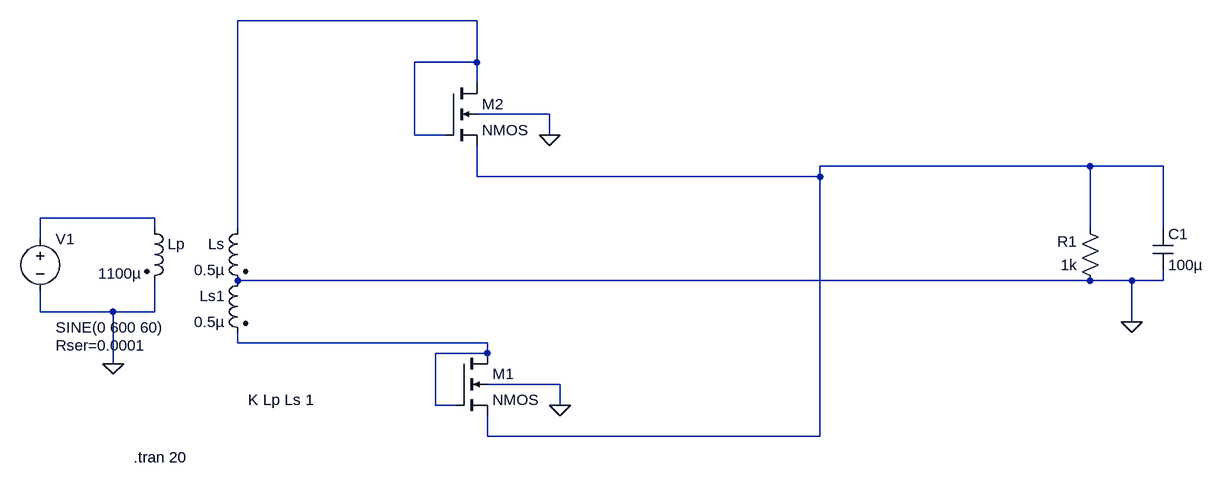
[diagram p0: schematic Rectification Sim.asc]
Rectification Sim.asc, the LTspice schematic file:
Version 4
SHEET 1 1284 680
WIRE 144 -192 -224 -192
WIRE 144 -128 144 -192
WIRE 144 -128 48 -128
WIRE 144 -96 144 -128
WIRE 256 -48 144 -48
WIRE 48 -16 48 -128
WIRE 96 -16 48 -16
WIRE 256 -16 256 -48
WIRE 1088 32 672 32
WIRE 1200 32 1088 32
WIRE 144 48 144 0
WIRE 672 48 672 32
WIRE 672 48 144 48
WIRE -352 112 -528 112
WIRE -352 128 -352 112
WIRE -224 128 -224 -192
WIRE 1088 128 1088 32
WIRE 1200 128 1200 32
WIRE -528 144 -528 112
WIRE 1088 208 -224 208
WIRE 1152 208 1088 208
WIRE 1200 208 1200 192
WIRE 1200 208 1152 208
WIRE -528 256 -528 224
WIRE -416 256 -528 256
WIRE -352 256 -352 208
WIRE -352 256 -416 256
WIRE 1152 272 1152 208
WIRE -224 304 -224 288
WIRE 160 304 -224 304
WIRE 160 320 160 304
WIRE 160 320 80 320
WIRE -416 336 -416 256
WIRE 272 368 160 368
WIRE 80 400 80 320
WIRE 112 400 80 400
WIRE 272 400 272 368
WIRE 160 448 160 416
WIRE 672 448 672 48
WIRE 672 448 160 448
FLAG -416 336 0
FLAG 1152 272 0
FLAG 272 400 0
FLAG 256 -16 0
SYMBOL voltage -528 128 R0
WINDOW 3 24 152 Left 2
WINDOW 123 24 124 Left 2
WINDOW 39 24 180 Left 2
SYMATTR Value SINE(0 600 60)
SYMATTR SpiceLine Rser=0.0001
SYMATTR InstName V1
SYMBOL ind2 -368 112 R0
WINDOW 3 -71 85 Left 2
SYMATTR InstName Lp
SYMATTR Value 1100µ
SYMATTR Type ind
SYMBOL ind2 -208 112 M0
SYMATTR InstName Ls
SYMATTR Value 0.5µ
SYMATTR Type ind
SYMBOL ind2 -208 192 M0
SYMATTR InstName Ls1
SYMATTR Value 0.5µ
SYMATTR Type ind
SYMBOL res 1104 224 R180
WINDOW 0 36 76 Left 2
WINDOW 3 36 40 Left 2
SYMATTR InstName R1
SYMATTR Value 1k
SYMBOL nmos4 112 320 R0
SYMATTR InstName M1
SYMBOL nmos4 96 -96 R0
SYMATTR InstName M2
SYMBOL cap 1184 128 R0
SYMATTR InstName C1
SYMATTR Value 100µ
TEXT -384 480 Left 2 !.tran 20
TEXT -208 392 Left 2 !K Lp Ls 1

The netlist it stands for:
* Rectification Sim.asc
V1 N003 0 SINE(0 600 60) Rser=0.0001
Lp N003 0 1100µ
Ls N001 0 0.5µ
Ls1 0 N004 0.5µ
R1 0 N002 1k
M1 N004 N004 N002 0 NMOS
M2 N001 N001 N002 0 NMOS
C1 N002 0 100µ
.model NMOS NMOS
.model PMOS PMOS
.lib standard.mos
.tran 20
K Lp Ls 1
.backanno
.end